# EAGLE design motor (EAGLE 5.11)
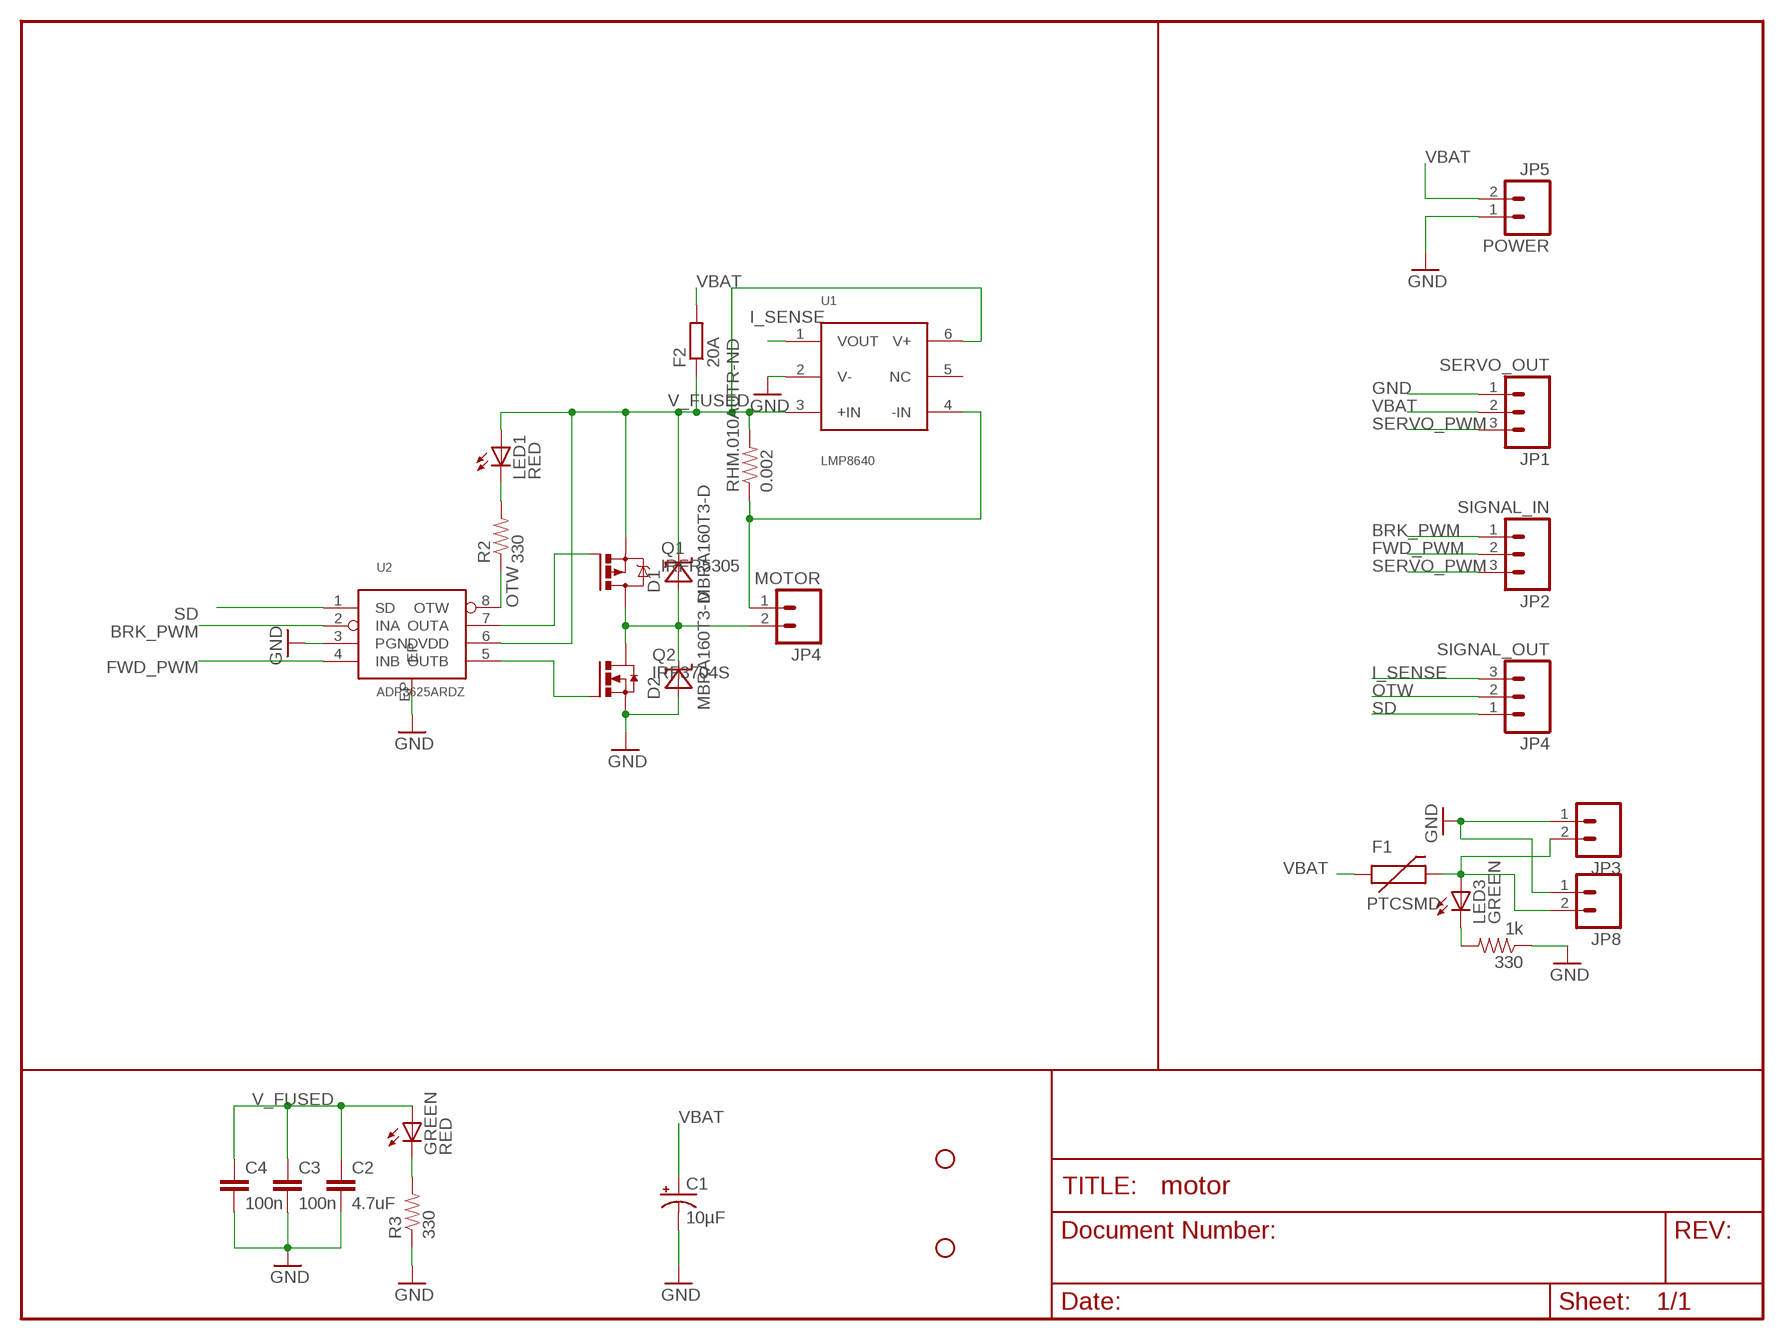
[diagram p0: schematic, sheet 1]

## Parts
330  1k  RESISTOR0603-RES  [0603-RES]
C1  10µF  CAP_POLD  [PANASONIC_D]
C2  4.7uF  CAP1206  [1206]
C3  100n  CAP0805  [0805]
C4  100n  CAP0805  [0805]
D1  MBRA160T3-D  [SMA-403D]
D2  MBRA160T3-D  [SMA-403D]
F1  PTCSMD  [PTC-1206]
F2  20A  R-EU_R1206  [R1206]
GREEN  RED  LED0603  [LED-0603]
JP1  SERVO_OUT  M03POLAR  [MOLEX-1X3]
JP2  SIGNAL_IN  M03POLAR  [MOLEX-1X3]
JP3  M02POLAR  [MOLEX-1X2]
JP4  MOTOR  M02PTH4  [1X02_XTRA_BIG]
JP5  POWER  M02PTH4  [1X02_XTRA_BIG]
JP6  STAND-OFF  [STAND-OFF]
JP7  STAND-OFF  [STAND-OFF]
JP8  M02POLAR  [MOLEX-1X2]
LED1  RED  LED0603  [LED-0603]
LED3  GREEN  LED0603  [LED-0603]
Q1  IRFR5305  [D-PAK_TO252AA]
Q2  IRF3704S  [D2PACK]
R2  330  RESISTOR0603-RES  [0603-RES]
R3  330  RESISTOR0603-RES  [0603-RES]
RHM.010AUTR-ND  0.002  RESISTOR2512  [R2512]
SIGNAL_OUT  JP4  M03POLAR  [MOLEX-1X3]
U1  LMP8640  [TSOT-8]
U2  ADP3625ARDZ  [SO-8-AD]

## Nets
BRK_PWM: JP2.1 U2.2(INA)
FWD_PWM: JP2.2 U2.4(INB)
GND: 330.1 C1.- C2.2 C3.2 C4.2 D2.A JP1.1 JP3.1 JP5.1 JP8.1 Q2.3(S) R3.1 U1.2(V-) U2.3(PGND) U2.EP
I_SENSE: SIGNAL_OUT.3 U1.1(VOUT)
N$1: D1.A D2.C JP4.2 Q1.4(D) Q2.2(D)
N$2: Q1.1(G) U2.7(OUTA)
N$3: JP4.1 RHM.010AUTR-ND.1 U1.4(-IN)
N$4: GREEN.C R3.2
N$5: Q2.1(G) U2.5(OUTB)
N$6: 330.2 LED3.C
N$7: LED1.C R2.2
OTW: R2.1 SIGNAL_OUT.2 U2.8(OTW)
SD: SIGNAL_OUT.1 U2.1(SD)
SERVO_PWM: JP1.3 JP2.3
V_FUSED: C2.1 C3.1 C4.1 D1.C F2.1 GREEN.A LED1.A Q1.3(S) RHM.010AUTR-ND.2 U1.3(+IN) U1.6(V+) U2.6(VDD)
VBAT: C1.+ F1.1 F2.2 JP1.2 JP5.2
VOUT: F1.2 JP3.2 JP8.2 LED3.A
Unconnected: U1.5(NC)

## Library data of the parts
330 R2 R3 RHM.010AUTR-ND = SparkFun:RESISTOR: Resistor Basic schematic elements and footprints for 0603, 1206, and PTH resistors.
C1 = SparkFun:CAP_POL: Capacitor Polarized These are standard SMD and PTH capacitors. Normally 10uF, 47uF, and 100uF in electrolytic and tantalum varieties. Always verify the external diameter of the through hole cap, it varies with capacity, voltage, and manufacturer. The EIA devices should be standard.
C2-C4 = SparkFun:CAP: Capacitor Standard 0603 ceramic capacitor, and 0.1" leaded capacitor.
D1 D2 = William:MBRA160T3-D
F1 = SparkFun:PTC: Resettable Fuse PTC Resettable Fuse. Spark Fun Electronics SKU : COM-08357
F2 = rcl:R-EU_: RESISTOR, European symbol
GREEN LED1 LED3 = SparkFun:LED: LEDs Standard schematic elements and footprints for 5mm, 3mm, 1206, and 0603 sized LEDs. 5mm - Spark Fun Electronics SKU : COM-00529 (and others)
JP1 JP2 SIGNAL_OUT = SparkFun:M03: Header 3 Standard 3-pin 0.1" header. Use with straight break away headers (SKU : PRT-00116), right angle break away headers (PRT-00553), swiss pins (PRT-00743), machine pins (PRT-00117), and female headers (PRT-00115). Molex polarized connector foot print use with SKU : PRT-08232 with associated crimp pins and housings.
JP3-JP5 JP8 = SparkFun:M02: Header 2 Standard 2-pin 0.1" header. Use with straight break away headers (SKU : PRT-00116), right angle break away headers (PRT-00553), swiss pins (PRT-00743), machine pins (PRT-00117), and female headers (PRT-00115). Molex polarized connector foot print use with SKU : PRT-08233 with associated crimp pins and housings.
JP6 JP7 = SparkFun:STAND-OFF: Stand Off This is the mechanical footprint for a #4 phillips button head screw. Use the keepout ring to avoid running the screw head into surrounding components. SKU : PRT-00447
Q1 = transistor-power:IRF?5305: HEXFET Power MOSFET Source: http://www.irf.com/product-info/datasheets/data/irfr5305pbf.pdf
Q2 = transistor-power:IRF3704: SMPS MOSFET HEXFET® Power MOSFET Source: http://www.irf.com/product-info/datasheets/data/irf3704.pdf
U1 = William:LMP8640
U2 = William:ADP3625ARDZ

## Board
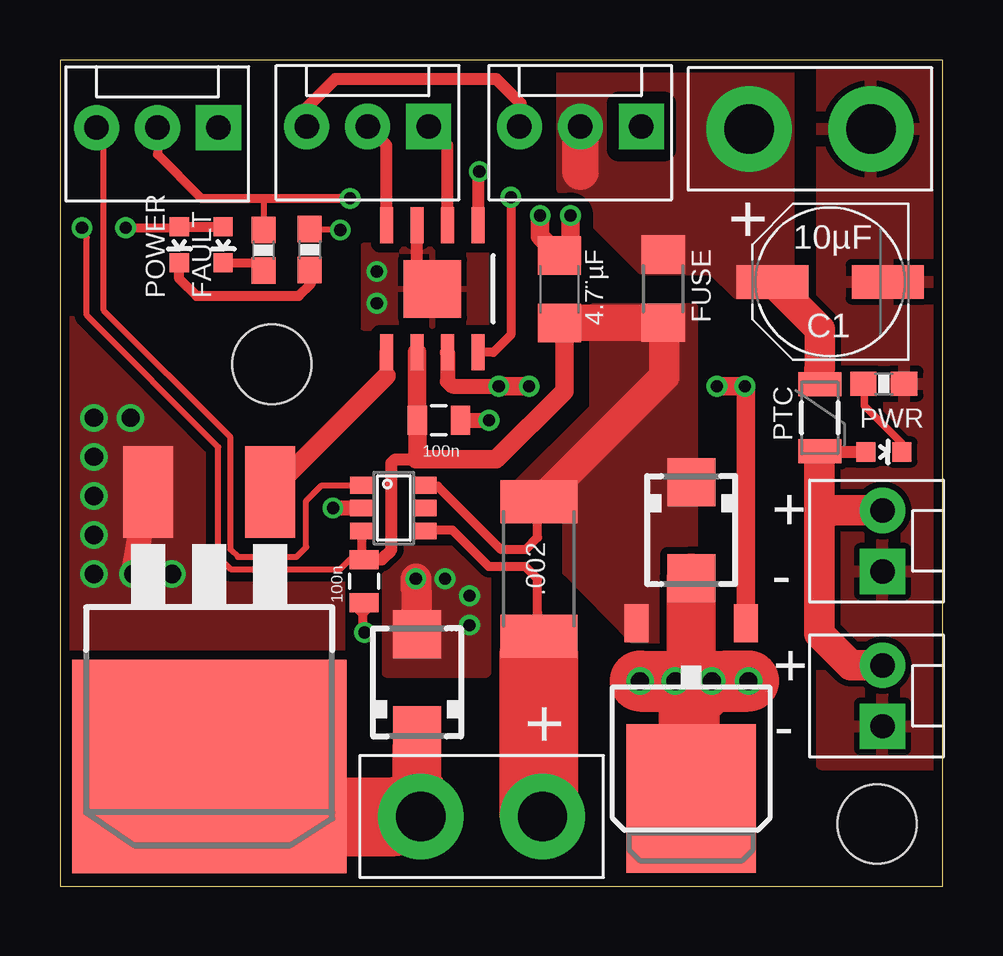
[diagram p1: board, top side]
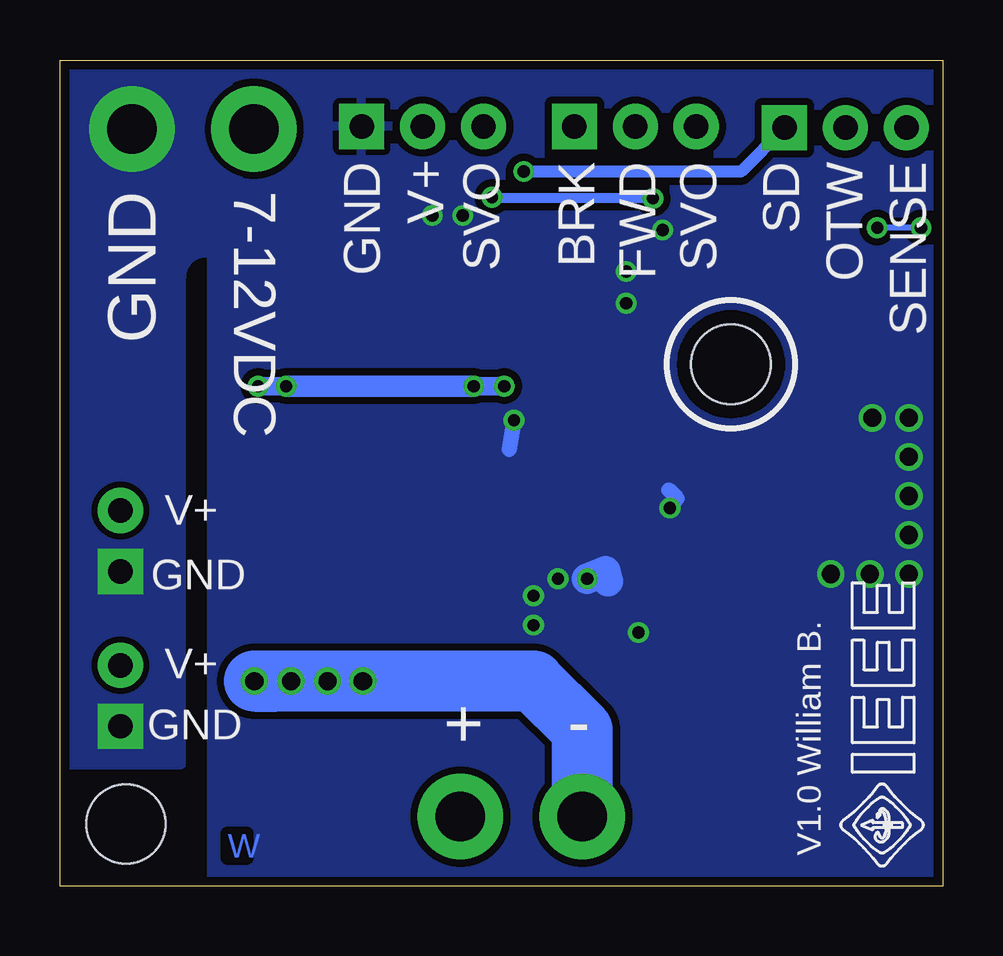
[diagram p2: board, bottom side, seen from below]

Size 36.81 x 34.42 mm. Coordinates in mm from the lower left corner, seen from the top.
Outline: 0,0 36.81,0 36.81,34.42 0,34.42 0,0
Copper layers (1*16): Top 0.0356mm / dielectric 1.5011mm / Bottom 0.0356mm
Design rules "LaenPCBOrder": minimum track width 6mil, minimum drill 13mil, track to track 6mil, track to pad 6mil, pad to pad 6mil, via to via 6mil, smd to smd 6mil, copper to edge 15mil, drill to drill 6mil, minimum pad ring 7mil, minimum via ring 7mil, stop-mask expansion 4mil, vias tented up to drill 0mil, thermal gap 10mil

### Footprints (pad centres in the part's own frame; a part is rotated, then mirrored left to right if it is on the bottom)
0603-RES = smd 1.1 x 1: 1 -0.85,0; 2 0.85,0
PANASONIC_D = smd 3 x 1.4: + 2.4,0; - -2.4,0
1206 = smd 1.6 x 1.8: 1 -1.4,0; 2 1.4,0
0805 = smd 0.8 x 1.2: 1 -0.9,0; 2 0.9,0
SMA-403D = smd 2 x 2: A 2,0; C -2,0
PTC-1206 = smd 1 x 1.8: 1 -1.4,0; 2 1.4,0
R1206 = smd 1.6 x 1.803: 1 -1.422,0; 2 1.422,0
LED-0603 = smd 0.8 x 0.8: A 0,-0.75; C 0,0.75
MOLEX-1X3 = drill 1.016 pad 1.88 square: 1 0,0 | drill 1.016 pad 1.88 round: 2 2.54,0; 3 5.08,0
MOLEX-1X2 = drill 1.016 pad 1.88 square: 1 0,0 | drill 1.016 pad 1.88 round: 2 2.54,0
1X02_XTRA_BIG = drill 2.057 pad 3.556 round: 1 -2.54,0; 2 2.54,0
STAND-OFF = hole 3.302: 0,0
D-PAK_TO252AA = smd 1 x 1.6: 1 -2.28,-4.8; 3 2.28,-4.8 | smd 5.4 x 6.2: 4 0,2.5
D2PACK = smd 2.083 x 3.81: 1 -2.54,-8.89; 3 2.54,-8.89 | smd 11.43 x 8.89: 2 0,2.54
R2512 = smd 1.8 x 3.2: 1 -2.8,0; 2 2.8,0
TSOT-8 = smd 0.69 x 1: 1 -0.95,0; 2 0,0; 3 0.95,0; 4 0.95,2.6; 5 0,2.6; 6 -0.95,2.6
SO-8-AD = smd 0.533 x 1.5: 1 0,0; 2 1.27,0; 3 2.54,0; 4 3.81,0; 5 3.81,5.3; 6 2.54,5.3; 7 1.27,5.3; 8 0,5.3 | smd 2.4 x 2.4: EP 1.9,2.65

### Placement (x,y rotation side)
330  34.34,20.93 180 top
C1  32.11,25.17 180 top
C2  20.83,24.87 90 top
C3  12.67,12.7 270 top
C4  15.8,19.41 0 top
D1  26.31,14.83 270 top
D2  14.88,8.48 90 top
F1  31.67,19.51 270 top
F2  25.15,24.89 90 top
GREEN  4.98,26.72 180 top
JP1  24.23,31.65 180 top
JP2  15.37,31.65 180 top
JP3  34.29,6.65 90 top
JP4  17.58,2.9 180 top
JP5  31.27,31.55 180 top
JP6  34.06,2.59 0 top
JP7  8.84,21.74 0 top
JP8  34.29,13.11 90 top
LED1  6.81,26.72 180 top
LED3  34.34,18.08 270 top
Q1  26.31,6.15 180 top
Q2  6.22,7.52 180 top
R2  8.48,26.49 270 top
R3  10.41,26.52 270 top
RHM.010AUTR-ND  19.96,13.21 90 top
SIGNAL_OUT  6.6,31.6 180 top
U1  12.6,15.75 270 top
U2  17.42,27.53 180 top
U$6  [IEEE-LOGO-2-SM]  2.54,2.54 90 bottom

### Tracks (layer width: path | path; a pad name or v marks a point on that pad's centre or on a via)
BRK_PWM
  Top 0.508: U2.2 16.15,30.86 JP2.1
FWD_PWM
  Top 0.508: U2.4 13.61,30.86 JP2.2
GND  (via drill 0.51, 0.76)
  Top 0.254: R3.1 11.34,27.37 v11.68,27.33
  Top 0.381: 12.62,11.61 12.62,10.64 v12.7,10.57
  Top 0.508: U2.3 14.88,25.76 15.24,25.4 15.24,25.17 U2.EP | C2.2 21.33,26.37
  Top 0.635: U1.2 v11.38,15.75 | C4.2 v17.88,19.41
  Top 0.762: C3.2 12.62,11.61 | v20.02,27.94 20.02,27.08 C2.2 | v21.29,27.94 21.29,26.47 20.93,26.11
  Top 1.016: v3.05,13.01 3.58,16.03
  Top 1.27: D2.A 14.88,10.82 v14.83,12.8 | 3.58,16.03 Q2.3
  Bottom 0.635: v11.38,15.75 11.07,16.15 11.43,16.51 | v17.88,19.41 18.09,18.19
  Bottom 1.27: v14.83,12.8 14.07,13.11 13.97,12.7
  other vias: 13.21,25.6 13.21,24.28 2.95,19.51 1.42,19.51 1.42,17.88 1.42,16.26 1.42,14.63 1.42,13 4.67,13 17.07,12.09 16.05,12.8 17.07,10.87
  pour Bottom (isolate 0.305): 0,34.29 0,0 30.48,0 30.48,34.29
  pour Top (isolate 0.381, no thermals): 0,24.13 0,0 11.79,0 11.79,12.7
  pour Top (isolate 0.381): 17.78,26.67 12.65,26.67 12.65,23.27 17.78,23.27
  pour Top (isolate 0.254): 36.83,34.29 31.75,34.29 31.75,5.08 36.83,5.08
  pour Top (isolate 0.254, no thermals): 17.78,13.97 13.61,13.97 13.61,8.89 17.78,8.89
  pour Bottom (isolate 0.254, no thermals): 30.48,34.29 36.83,34.29 36.83,5.08 31.75,5.08 31.75,25.37 arc92 30.69,26.4 29.51,26.37 29.21,33.02
I_SENSE
  Top 0.254: U1.1 10.91,16.7 10.26,16.05 10.26,14.12 9.86,13.72 7.42,13.72 7.11,14.02 7.11,18.69 1.83,23.98 1.83,31.29 SIGNAL_OUT.3
N$1  (via drill 0.76)
  Top 0.254: Q1.4 27.33,4.66
  Top 1.27: 14.88,5.74 D2.C
  Top 2.032: D1.A 26.31,7.72 26.21,7.62 | 14.88,3.81 14.88,5.74
  Top 2.54: JP4.2 13.97,2.9 14.88,3.81 | Q2.2 8.41,2.9 | 27.79,8.53 v28.7,8.53 v27.18,8.53 | v27.18,8.53 v25.65,8.53 v24.18,8.53 | v27.18,8.53 26.21,7.62 26.21,3.75 Q1.4
  Top 3.302: 8.41,2.9 13.97,2.9
  Bottom 2.54: JP4.2 15.04,6.5 17.07,8.53 v24.18,8.53 v25.65,8.53 v27.18,8.53 v28.7,8.53 27.79,8.53
N$2  (via drill 0.51)
  Top 0.635: U2.7 16.15,21.03 16.36,20.83 v18.29,20.83
  Top 0.762: v18.29,20.83 19.61,20.83 | v27.38,20.83 28.59,20.83 28.59,20.17 Q1.1
  Bottom 0.762: v18.29,20.83 v19.56,20.83 | v27.38,20.83 v28.55,20.83
  Bottom 0.889: v19.56,20.83 v27.38,20.83
N$3
  Top 0.381: RHM.010AUTR-ND.1 19.91,10.46 | U1.4 15.23,14.83 16.36,14.83 17.88,13.31 19.41,13.31 19.91,12.8 19.91,11.38 19.91,7.67
  Top 0.508: 19.96,7.62 19.91,7.67
  Top 1.27: 19.91,9.65 19.91,10.36 RHM.010AUTR-ND.1
  Top 2.54: JP4.1 19.96,3.05 | 19.96,9.6 19.91,9.65
  Top 3.302: 19.96,3.05 19.96,7.62 19.96,9.6
N$4
  Top 0.406: GREEN.C 4.98,25.3 5.69,24.59 9.96,24.59 10.46,25.09 10.46,25.62 R3.2
N$5
  Top 0.584: 13.61,21.26 U2.5
  Top 0.762: 8.97,16.89 Q2.1 13.61,21.26
N$6
  Top 0.305: LED3.C 35.09,18.45 33.53,20.02 33.53,20.89 330.2
N$7
  Top 0.254: 8.15,25.97 R2.2
  Top 0.381: LED1.C 8.15,25.97
OTW  (via drill 0.51)
  Top 0.254: R2.1 8.48,28.6 8.43,28.65
  Top 0.381: SIGNAL_OUT.2 4.06,30.48 5.89,28.65 8.43,28.65 v12.09,28.65 | U2.8 18.07,22.23 18.8,22.96 v18.8,28.7
  Bottom 0.406: v12.09,28.65 18.75,28.65 v18.8,28.7
SD  (via drill 0.51)
  Top 0.508: U2.1 17.42,29.72 v17.48,29.77
  Bottom 0.508: v17.48,29.77 8.43,29.77 SIGNAL_OUT.1
SERVO_PWM
  Top 0.406: JP1.3 19.2,31.65 19.2,31.7
  Top 0.508: JP2.3 10.29,32.44 11.48,33.63 18.19,33.63 19.2,32.61 19.2,31.7
V_FUSED  (via drill 0.51)
  Top 0.203: 19.91,14.53 19.81,14.53 19.81,15.95
  Top 0.254: v0.91,27.43 1.12,27.03 1.12,23.77 6.6,18.29 6.6,13.72 7.11,13.21 11.68,13.21 12.09,13.61 12.66,13.61 C3.1
  Top 0.381: 12.58,13.7 12.58,14.78 U1.3 | v2.74,27.43 5.04,27.43 GREEN.A | 19.91,15.96 19.91,14.53 19.41,14.02 18.39,14.02 15.75,16.66 15.23,16.66 U1.6
  Top 0.406: GREEN.A LED1.A
  Top 0.508: 19.91,15.96 RHM.010AUTR-ND.2 | 12.58,13.7 C3.1 12.69,13.61 13.41,13.61 13.82,14.02 13.82,17.63 13.97,17.78 14.83,17.78
  Top 0.762: C2.1 21.03,23.26 21.03,20.62 18.19,17.78 14.94,17.78 | 14.83,17.78 14.94,17.78 | 14.94,17.78 14.9,17.82 C4.1 14.88,19.42 U2.6
  Top 1.27: 23.67,23.52 F2.1 25.2,23.42 25.2,21.23 19.91,15.95 19.81,15.95
  Top 1.524: F2.1 C2.1
  Bottom 0.254: v0.91,27.43 v2.74,27.43
  pour Top (isolate 0.305, no thermals): 26.21,24.08 22.25,24.08 22.25,19.91 18.8,16.46 21.13,15.24 21.13,13.11 23.88,10.31 26.42,10.31 26.42,24.08 26.21,23.67
VBAT
  Top 0.508: 31.65,21.54 31.65,20.93 F1.1
  Top 1.27: C1.+ 31.67,23.2 31.67,21.57 31.65,21.54
  Top 1.524: 21.69,29.77 JP1.2
  pour Top (isolate 0.508, no thermals): 20.93,34.14 20.93,29.06 24.28,25.7 27.23,25.7 28.24,24.69 30.38,24.69 30.38,33.93 26.21,33.93 26.01,34.04 25.4,34.04
VOUT
  Top 0.508: 31.65,17.93 31.67,17.96 F1.2 31.7,18.09 LED3.A
  Top 1.27: JP3.2 32.97,9.2 31.65,10.52 31.65,15.24 | 31.65,15.24 31.65,17.93 | JP8.2 32.05,15.65 31.65,15.24

### Text on the board
Bottom: W
tNames: + | POWER | FAULT | 4.7¨µF | FUSE | PTC | PWR | 100n | + | 100n | .002 | - | + | + | -
bNames: SENSE | OTW | SD | SVO | FWD | BRK | SVO | V+ | GND | 7-12VDC | GND | V+ | GND | V+ | GND | - | + | V1.0 William B.